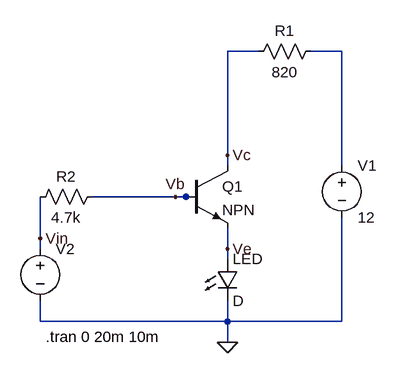
[diagram p0: schematic lab4_3.asc]
lab4_3.asc, the LTspice schematic file:
Version 4
SHEET 1 880 680
WIRE 416 -144 368 -144
WIRE 544 -144 496 -144
WIRE 368 16 368 -144
WIRE 368 32 368 16
WIRE 544 32 544 -144
WIRE 288 80 160 80
WIRE 304 80 288 80
WIRE 320 80 304 80
WIRE 80 144 80 80
WIRE 80 160 80 144
WIRE 368 160 368 128
WIRE 368 176 368 160
WIRE 80 272 80 240
WIRE 368 272 368 240
WIRE 368 272 80 272
WIRE 544 272 544 112
WIRE 544 272 368 272
WIRE 368 304 368 272
FLAG 368 304 0
FLAG 368 16 Vc
FLAG 368 160 Ve
FLAG 288 80 Vb
FLAG 80 144 Vin
SYMBOL voltage 80 144 R0
WINDOW 3 24 96 Invisible 2
WINDOW 123 0 0 Left 0
WINDOW 39 0 0 Left 0
SYMATTR Value PULSE(0 5 0 0 0 1e-3 2e-3)
SYMATTR InstName V2
SYMBOL res 64 96 R270
WINDOW 0 32 56 VTop 2
WINDOW 3 0 56 VBottom 2
SYMATTR InstName R2
SYMATTR Value 4.7k
SYMBOL res 400 -128 R270
WINDOW 0 32 56 VTop 2
WINDOW 3 0 56 VBottom 2
SYMATTR InstName R1
SYMATTR Value 820
SYMBOL voltage 544 16 R0
WINDOW 123 0 0 Left 0
WINDOW 39 0 0 Left 0
SYMATTR InstName V1
SYMATTR Value 12
SYMBOL LED 352 176 R0
SYMATTR InstName LED
SYMBOL npn 304 32 R0
SYMATTR InstName Q1
TEXT 88 296 Left 2 !.tran 0 20m 10m

The netlist it stands for:
* lab4_3.asc
V2 Vin 0 PULSE(0 5 0 0 0 1e-3 2e-3)
R2 Vin Vb 4.7k
R1 Vc N001 820
V1 N001 0 12
D§LED Ve 0 D
Q1 Vc Vb Ve 0 NPN
.model D D
.lib standard.dio
.model NPN NPN
.model PNP PNP
.lib standard.bjt
.tran 0 20m 10m
.backanno
.end